# EAGLE design Qwiic LED Stick (EAGLE 9.5.2)
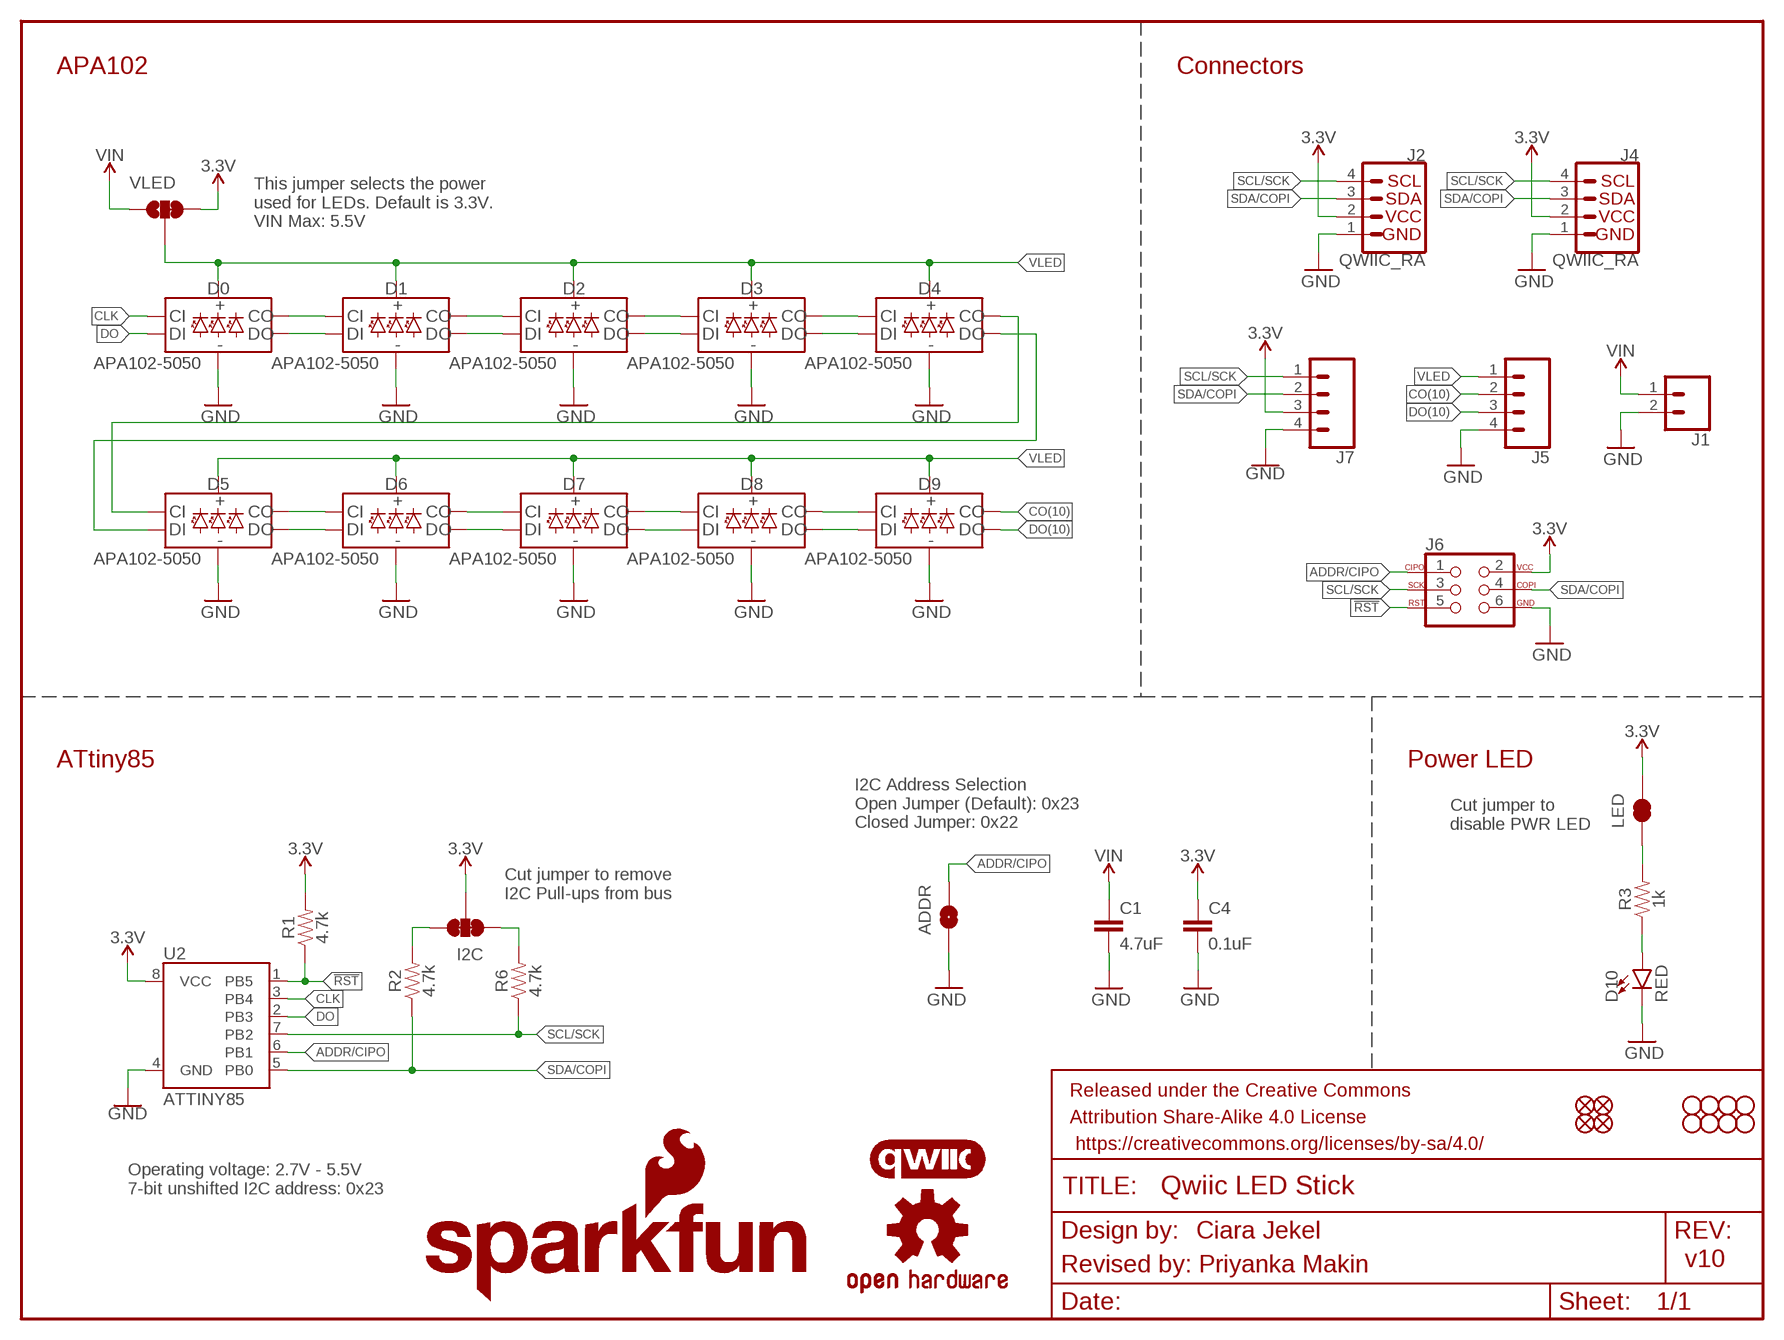
[diagram p0: schematic, sheet 1]

## Parts
ADDR  JUMPER-SMT_2_NO_SILK  [SMT-JUMPER_2_NO_SILK]
C1  4.7uF  4.7UF-0603-6.3V-(10%)  [0603]
C4  0.1uF  0.1UF-0603-25V-(+80/-20%)  [0603]
D0  APA102-5050  [APA102-5050]
D1  APA102-5050  [APA102-5050]
D2  APA102-5050  [APA102-5050]
D3  APA102-5050  [APA102-5050]
D4  APA102-5050  [APA102-5050]
D5  APA102-5050  [APA102-5050]
D6  APA102-5050  [APA102-5050]
D7  APA102-5050  [APA102-5050]
D8  APA102-5050  [APA102-5050]
D9  APA102-5050  [APA102-5050]
D10  RED  LED-RED0603  [LED-0603]
FRAME1  FRAME-LETTER  [CREATIVE_COMMONS]
H1  STAND-OFF  [STAND-OFF]
H2  STAND-OFF  [STAND-OFF]
H3  STAND-OFF  [STAND-OFF]
H4  STAND-OFF  [STAND-OFF]
I2C  JUMPER-SMT_3_2-NC_TRACE_SILK  [SMT-JUMPER_3_2-NC_TRACE_SILK]
J1  CONN_021X02_NO_SILK  [1X02_NO_SILK]
J2  QWIIC_RA  QWIIC_CONNECTORJS-1MM  [JST04_1MM_RA]
J4  QWIIC_RA  QWIIC_CONNECTORJS-1MM  [JST04_1MM_RA]
J5  CONN_041X04_NO_SILK  [1X04_NO_SILK]
J6  AVR_SPI_PROG_3X2TESTPOINTS  [2X3_TEST_POINTS]
J7  CONN_041X04_NO_SILK_NO_POP  [1X04_NO_SILK]
JP1  FIDUCIALUFIDUCIAL  [FIDUCIAL-MICRO]
JP2  FIDUCIALUFIDUCIAL  [FIDUCIAL-MICRO]
JP3  STAND-OFF  [STAND-OFF]
JP4  STAND-OFF  [STAND-OFF]
JP5  FIDUCIALUFIDUCIAL  [FIDUCIAL-MICRO]
JP6  FIDUCIALUFIDUCIAL  [FIDUCIAL-MICRO]
JP7  STAND-OFF  [STAND-OFF]
JP8  STAND-OFF  [STAND-OFF]
LED  JUMPER-SMT_2_NC_TRACE_SILK  [SMT-JUMPER_2_NC_TRACE_SILK]
LOGO1  OSHW-LOGOMINI  [OSHW-LOGO-MINI]
LOGO2  SFE_LOGO_NAME.2_INCH  [SFE_LOGO_NAME_.2]
LOGO3  QWIIC_LOGO_5MM  [QWIIC_5MM]
LOGO4  SFE_LOGO_FLAME.2_INCH  [SFE_LOGO_FLAME_.2]
LOGO5  SFE_LOGO_NAME.2_INCH  [SFE_LOGO_NAME_.2]
R1  4.7k  4.7KOHM-0603-1/10W-1%  [0603]
R2  4.7k  4.7KOHM-0603-1/10W-1%  [0603]
R3  1k  1KOHM-0603-1/10W-1%  [0603]
R6  4.7k  4.7KOHM-0603-1/10W-1%  [0603]
U2  ATTINY85  [ATTINY85]
VLED  JUMPER-SMT_3_1-NC_TRACE_SILK  [SMT-JUMPER_3_1-NC_TRACE_SILK]

## Nets
3.3V: C4.1 I2C.2 J2.2 J4.2 J6.2 J7.3 LED.2 R1.2 U2.8(VCC) VLED.3
!RST: J6.5 R1.1 U2.1(PB5)
ADDR/CIPO: ADDR.2 J6.1 U2.6(PB1)
CLK: D0.P2(CI) U2.3(PB4)
CO(10): D9.P5(CO) J5.2
DO: D0.P1(DI) U2.2(PB3)
DO(10): D9.P6(DO) J5.3
GND: ADDR.1 C1.2 C4.2 D0.P3(GND) D1.P3(GND) D2.P3(GND) D3.P3(GND) D4.P3(GND) D5.P3(GND) D6.P3(GND) D7.P3(GND) D8.P3(GND) D9.P3(GND) D10.C J1.2 J2.1 J4.1 J5.4 J6.6 J7.4 U2.4(GND)
N$3: D10.A R3.1
N$4: LED.1 R3.2
N$5: I2C.3 R2.2
N$6: I2C.1 R6.2
N$8: D8.P6(DO) D9.P1(DI)
N$9: D8.P5(CO) D9.P2(CI)
N$10: D7.P5(CO) D8.P2(CI)
N$11: D7.P6(DO) D8.P1(DI)
N$12: D6.P5(CO) D7.P2(CI)
N$13: D6.P6(DO) D7.P1(DI)
N$14: D5.P5(CO) D6.P2(CI)
N$15: D5.P6(DO) D6.P1(DI)
N$16: D4.P5(CO) D5.P2(CI)
N$17: D4.P6(DO) D5.P1(DI)
N$18: D3.P5(CO) D4.P2(CI)
N$19: D3.P6(DO) D4.P1(DI)
N$20: D2.P6(DO) D3.P1(DI)
N$21: D2.P5(CO) D3.P2(CI)
N$22: D1.P6(DO) D2.P1(DI)
N$23: D1.P5(CO) D2.P2(CI)
N$24: D0.P5(CO) D1.P2(CI)
N$25: D0.P6(DO) D1.P1(DI)
SCL/SCK: J2.4 J4.4 J6.3 J7.1 R6.1 U2.7(PB2)
SDA/COPI: J2.3 J4.3 J6.4 J7.2 R2.1 U2.5(PB0)
VIN: C1.1 J1.1 VLED.1
VLED: D0.P4(VCC) D1.P4(VCC) D2.P4(VCC) D3.P4(VCC) D4.P4(VCC) D5.P4(VCC) D6.P4(VCC) D7.P4(VCC) D8.P4(VCC) D9.P4(VCC) J5.1 VLED.2

## Notes on the sheet
- APA102 | Connectors
- This jumper selects the power 
  used for LEDs. Default is 3.3V.
  VIN Max: 5.5V
- ATtiny85 | Power LED
- I2C Address Selection
  Open Jumper (Default): 0x23
  Closed Jumper: 0x22
- Cut jumper to 
  disable PWR LED
- Cut jumper to remove 
  I2C Pull-ups from bus
- Operating voltage: 2.7V - 5.5V
  7-bit unshifted I2C address: 0x23
- Ciara Jekel
- Revised by: Priyanka Makin | v10

## Library data of the parts
ADDR = SparkFun-Jumpers:JUMPER-SMT_2_NO: Normally open jumper This jumper has two pads in close proximity to each other. Apply solder to close the connection. Round pads are easier to solder for beginners, but are a lot larger. SparkFun Product that uses the round pads: SparkFun EL Sequencer <https://www.sparkfun.com/products/12781>
C1 = SparkFun-Capacitors:4.7UF: 4.7µF ceramic capacitors A capacitor is a passive two-terminal electrical component used to store electrical energy temporarily in an electric field.; PROD_ID: CAP-08280
C4 = SparkFun-Capacitors:0.1UF: 0.1µF ceramic capacitors A capacitor is a passive two-terminal electrical component used to store electrical energy temporarily in an electric field.; PROD_ID: CAP-00810
D0 D1-D9 = SparkFun-LED:APA102: Addressable RGB LED - 2 Wire Common names: APA102, Dotstar, etc. Packages: 5050 2020 SparkFun Products: SparkFun Lumenati Boards <https://www.sparkfun.com/categories/405>; PROD_ID: DIO-13739
D10 = SparkFun-LED:LED-RED: Red SMD LED Used in manufacturing of most products at SparkFun Packages: 0603 - SMD 0603 package [Product Link] <http://docs.avagotech.com/docs/AV02-0551EN> 0603 SMART - SMD 0603 SMART package ( more efficient and expensive)[Product Link] <http://www.osram-os.com/Graphics/XPic2/00077099_0.pdf> 1206 - SMD1206 package [Product Link] <https://www.sparkfun.com/datasheets/DevTools/LilyPad/Q150OVS4.pdff> SparkFun Products: Pro Mini 328 -5V <https://www.sparkfun.com/products/821> RedBoard <https://www.sparkfun.com/products/12757> IOIO-OTG <https://www.sparkfun.com/products/13613>; PROD_ID: DIO-00819
FRAME1 = SparkFun-Aesthetics:FRAME-LETTER: Schematic Frame - Letter Standard 8.5x11 US Letter frame
H1-H4 JP3 JP4 JP7 JP8 = SparkFun-Hardware:STAND-OFF: Stand Off Drill holes for mechanically mounting via screws, standoffs, etc. Note: Use the keepout ring to avoid running the screw head into surrounding components. Variant Overviews STAND-OFF - Mechanical footprint for a #4 phillips button head screw. STAND-OFF-TIGHT - Mechanical footprint for a #4 phillips button head screw, Example SparkFun Products Screw - Phillips Head (1/4", 4-40, 10 pack) <https://www.sparkfun.com/products/10453> (PRT-10453) Screw - Phillips Head (1/2", 4-40, 10 pack) <https://www.sparkfun.com/products/10452> (PRT-10452) Screw - Phillips Head (3/4", 4-40, 10 pack) <https://www.sparkfun.com/products/10451> (PRT-10451) Screw - Phillips Head (1", 4-40, 10 pack) <https://www.sparkfun.com/products/10450> (PRT-10450)
I2C = SparkFun-Jumpers:JUMPER-SMT_3_2-NC_TRACE: Normally closed trace jumper (2 of 2 connections) This jumper has a trace between all three pads so they are normally closed (NC). Use a razor knife to open the connection(s). For best results follow the IPC guidelines for cutting traces: Cutout at least 0.063 mm (0.005 in). Remove all loose material to clean up the cut area. Seal the cut with an approved epoxy. Reapply solder to reclose the connection(s).
J1 = SparkFun-Connectors:CONN_02: Multi connection point. Often used as Generic Header-pin footprint for 0.1 inch spaced/style header connections On any of the 0.1 inch spaced packages, you can populate with these: Break Away Headers - Straight <https://www.sparkfun.com/products/116> (PRT-00116) Break Away Male Headers - Right Angle <https://www.sparkfun.com/products/553> (PRT-00553) Female Headers <https://www.sparkfun.com/products/115> (PRT-00115) Break Away Headers - Machine Pin <https://www.sparkfun.com/products/117> (PRT-00117) Break Away Female Headers - Swiss Machine Pin <https://www.sparkfun.com/products/743> (PRT-00743) For SCREWTERMINALS and SPRING TERMINALS visit here: Screw Terimnals on SparkFun.com <https://www.sparkfun.com/search/results?term=Screw+Terminals> (5mm/3.5mm/2.54mm spacing) This device is also useful as a general connection point to wire up your design to another part of your project. Our various solder wires solder well into these plated through hole pads. Hook-Up Wire - Assortment (Stranded, 22 AWG) <https://www.sparkfun.com/products/11375> (PRT-11375) Hook-Up Wire - Assortment (Solid Core, 22 AWG) <https://www.sparkfun.com/products/11367> (PRT-11367) View the entire wire category on our website here <https://www.sparkfun.com/categories/141> Special notes: Molex polarized connector foot print use with: PRT-08233 with associated crimp pins and housings. 2.54_SCREWTERM for use with PRT-10571. 3.5mm Screw Terminal footprints for PRT-08084 5mm Screw Terminal footprints for use with PRT-08432
J2 J4 = SparkFun-Connectors:QWIIC_CONNECTOR: SparkFun I2C Standard Qwiic Connector An SMD 1mm pitch JST connector makes it easy and quick (get it? Qwiic?) to connect I2C devices to each other. The Qwiic system <http://www.sparkfun.com/qwiic> enables fast and solderless connection between popular platforms and various sensors and actuators. We carry 200mm <https://www.sparkfun.com/products/14204>, 100mm <https://www.sparkfun.com/products/14205>, 50mm <https://www.sparkfun.com/products/14206>, and breadboard friendly <https://www.sparkfun.com/products/14207> Qwiic cables. We also offer 10 pcs strips <https://www.sparkfun.com/products/14323> the SMD connectors.; PROD_ID: CONN-13694; VALUE: QWIIC_RIGHT_ANGLE
J5 = SparkFun-Connectors:CONN_04: Multi connection point. Often used as Generic Header-pin footprint for 0.1 inch spaced/style header connections On any of the 0.1 inch spaced packages, you can populate with these: Break Away Headers - Straight <https://www.sparkfun.com/products/116> (PRT-00116) Break Away Male Headers - Right Angle <https://www.sparkfun.com/products/553> (PRT-00553) Female Headers <https://www.sparkfun.com/products/115> (PRT-00115) Break Away Headers - Machine Pin <https://www.sparkfun.com/products/117> (PRT-00117) Break Away Female Headers - Swiss Machine Pin <https://www.sparkfun.com/products/743> (PRT-00743) For SCREWTERMINALS and SPRING TERMINALS visit here: Screw Terimnals on SparkFun.com <https://www.sparkfun.com/search/results?term=Screw+Terminals> (5mm/3.5mm/2.54mm spacing) This device is also useful as a general connection point to wire up your design to another part of your project. Our various solder wires solder well into these plated through hole pads. Hook-Up Wire - Assortment (Stranded, 22 AWG) <https://www.sparkfun.com/products/11375> (PRT-11375) Hook-Up Wire - Assortment (Solid Core, 22 AWG) <https://www.sparkfun.com/products/11367> (PRT-11367) View the entire wire category on our website here <https://www.sparkfun.com/categories/141> Special notes: Molex polarized connector foot print use with SKU : PRT-08231 with associated crimp pins and housings. 1MM SMD Version SKU: PRT-10208; PROD_ID: CONN-09696
J6 = SparkFun-Connectors:AVR_SPI_PROG_3X2: AVR ISP 6 Pin This is the reduced ISP connector for AVR programming. Common on Arduino. This footprint will take up less PCB space and can be used with a 10-pin to 6-pin adapter such as SKU: BOB-08508 **Special note about "TEST_POINT" package. The stop mask is on the top side, so if you want your programming test points to be on the bottom of your board, make sure to place this package on the bottom side of the board. This also ensure that the orientation to program from the bottom side will be correct. SparkFun Products: SparkFun ISP Pogo Adapter <https://www.sparkfun.com/products/11591> - NS Tiny AVR Programmer <https://www.sparkfun.com/products/11801> -PTH
J7 = SparkFun-Connectors:CONN_04: Multi connection point. Often used as Generic Header-pin footprint for 0.1 inch spaced/style header connections On any of the 0.1 inch spaced packages, you can populate with these: Break Away Headers - Straight <https://www.sparkfun.com/products/116> (PRT-00116) Break Away Male Headers - Right Angle <https://www.sparkfun.com/products/553> (PRT-00553) Female Headers <https://www.sparkfun.com/products/115> (PRT-00115) Break Away Headers - Machine Pin <https://www.sparkfun.com/products/117> (PRT-00117) Break Away Female Headers - Swiss Machine Pin <https://www.sparkfun.com/products/743> (PRT-00743) For SCREWTERMINALS and SPRING TERMINALS visit here: Screw Terimnals on SparkFun.com <https://www.sparkfun.com/search/results?term=Screw+Terminals> (5mm/3.5mm/2.54mm spacing) This device is also useful as a general connection point to wire up your design to another part of your project. Our various solder wires solder well into these plated through hole pads. Hook-Up Wire - Assortment (Stranded, 22 AWG) <https://www.sparkfun.com/products/11375> (PRT-11375) Hook-Up Wire - Assortment (Solid Core, 22 AWG) <https://www.sparkfun.com/products/11367> (PRT-11367) View the entire wire category on our website here <https://www.sparkfun.com/categories/141> Special notes: Molex polarized connector foot print use with SKU : PRT-08231 with associated crimp pins and housings. 1MM SMD Version SKU: PRT-10208
JP1 JP2 JP5 JP6 = SparkFun-Aesthetics:FIDUCIAL: Fiducial Alignment Points Point-of-reference for pick-and-place machines and other optical instruments.
LED = SparkFun-Jumpers:JUMPER-SMT_2_NC_TRACE: Normally closed trace jumper This jumper has a trace between two pads so it's normally closed (NC). Use a razor knife to open the connection. For best results follow the IPC guidelines for cutting traces: Cutout at least 0.063 mm (0.005 in). Remove all loose material to clean up the cut area. Seal the cut with an approved epoxy. Reapply solder to reclose the connection.
LOGO1 = SparkFun-Aesthetics:OSHW-LOGO: Open-Source Hardware (OSHW) Logo This logo indicates the piece of hardware it is found on incorporates a OSHW license and/or adheres to the definition of open source hardware found here: http://freedomdefined.org/OSHW
LOGO2 LOGO5 = SparkFun-Aesthetics:SFE_LOGO_NAME: SparkFun Font Logo This is the SparkFun name logo. The logo on the schematic will always be the same size; the package variant is the height of the flame part of the logo (or the height the flame would be, if it were drawn). Default layer for the logo on the board is tSilk.
LOGO3 = SparkFun-Aesthetics:QWIIC_LOGO: Qwiic Logos for placement on schematic and PCB. The 5.5mm silk logo is best for placing next to Qwiic connector.
LOGO4 = SparkFun-Aesthetics:SFE_LOGO_FLAME: SparkFun Flame Logo This is the SparkFun flame logo. The logo on the schematic will always be the same size; the package variant is the height of the flame. Default layer for the logo on the board is tSilk.
R1 R2 R6 = SparkFun-Resistors:4.7KOHM: 4.7kΩ resistor A resistor is a passive two-terminal electrical component that implements electrical resistance as a circuit element. Resistors act to reduce current flow, and, at the same time, act to lower voltage levels within circuits. - Wikipedia; PROD_ID: RES-07857
R3 = SparkFun-Resistors:1KOHM: 1kΩ resistor A resistor is a passive two-terminal electrical component that implements electrical resistance as a circuit element. Resistors act to reduce current flow, and, at the same time, act to lower voltage levels within circuits. - Wikipedia; PROD_ID: RES-07856
U2 = SparkFun-IC-Microcontroller:ATTINY85; PROD_ID: IC-09092
VLED = SparkFun-Jumpers:JUMPER-SMT_3_1-NC_TRACE: Normally closed trace jumper (1 of 2 connections) This jumper has a trace between two pads so it's normally closed (NC). The other connection is normally open (NO). Use a razor knife to open the connection. For best results follow the IPC guidelines for cutting traces: Cutout at least 0.063 mm (0.005 in). Remove all loose material to clean up the cut area. Seal the cut with an approved epoxy. Reapply solder to reclose the connection, or to close the NO connection.

## Net classes
1 power: width 0.203 mm

## Board
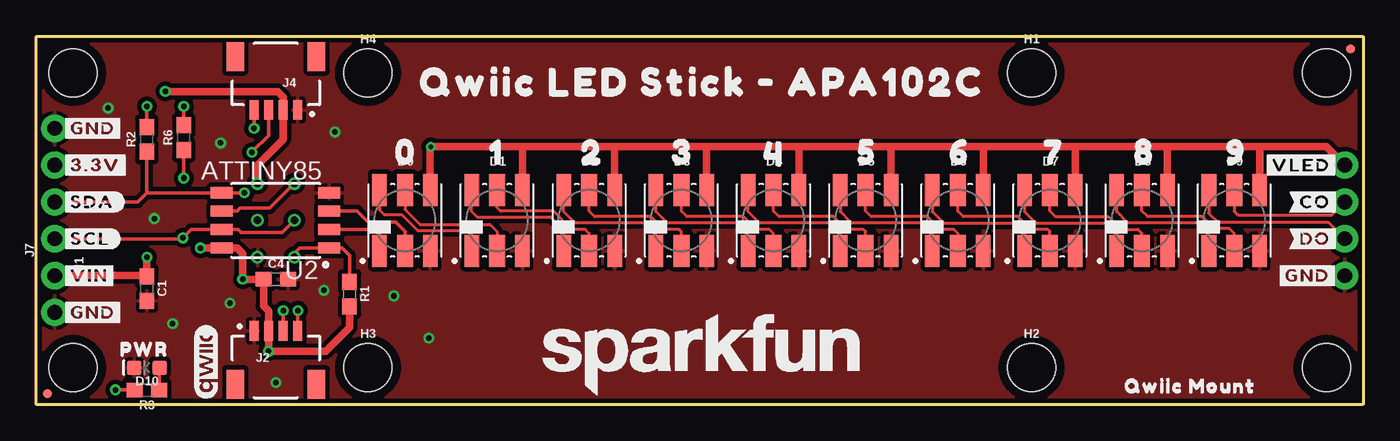
[diagram p1: board, top side]
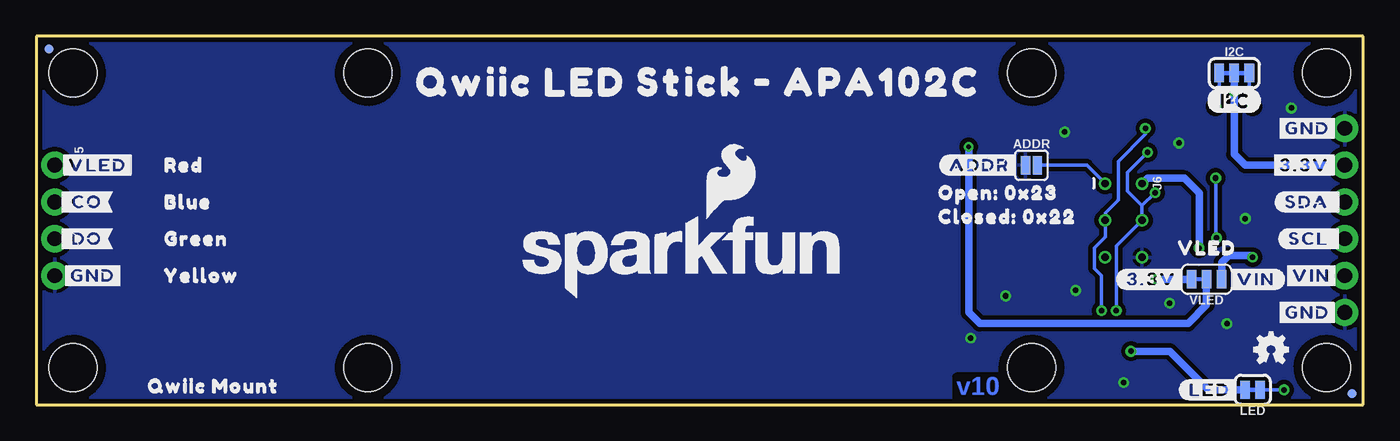
[diagram p2: board, bottom side, seen from below]

Size 91.44 x 25.4 mm. Coordinates in mm from the lower left corner, seen from the top.
Outline: 91.44,0 0,0 0,25.4 91.44,25.4 91.44,0
Copper layers (1*16): Top 0.035mm / dielectric 1.5mm / Bottom 0.035mm
Design rules "SparkFun-2-Layer-General-JLCPCB": minimum track width 7mil, minimum drill 0.3mm, track to track 7mil, track to pad 7mil, pad to pad 7mil, via to via 7mil, smd to smd 7mil, copper to edge 7mil, drill to drill 7mil, minimum pad ring 7mil, minimum via ring 7mil, stop-mask expansion 3mil, vias tented up to drill 25mil, thermal gap 10mil

### Footprints (pad centres in the part's own frame; a part is rotated, then mirrored left to right if it is on the bottom)
SMT-JUMPER_2_NO_SILK = smd 0.635 x 1.27: 1 -0.406,0; 2 0.406,0
0603 = smd 1.1 x 1: 1 -0.85,0; 2 0.85,0
APA102-5050 = smd 1 x 2.2: P1 -1.75,-2.1; P3 1.75,-2.1; P4 1.75,2.1; P6 -1.75,2.1 | smd 1.1 x 2.2: P2 0,-2.1; P5 0,2.1
LED-0603 = smd 1 x 1: A -0.877,0; C 0.877,0
STAND-OFF = hole 3.302: 0,0
SMT-JUMPER_3_2-NC_TRACE_SILK = smd 0.66 x 1.27: 1 -1.041,0; 2 0,0; 3 1.041,0
1X02_NO_SILK = drill 1.016 pad 1.88: 1 0,0; 2 2.54,0
JST04_1MM_RA = smd 0.6 x 1.35: 1 -1.5,0; 2 -0.5,0; 3 0.5,0; 4 1.5,0 | smd 1.2 x 2: NC1 2.8,-3.675; NC2 -2.8,-3.675
1X04_NO_SILK = drill 1.016 pad 1.88: 1 0,0; 2 2.54,0; 3 5.08,0; 4 7.62,0
2X3_TEST_POINTS = drill 0.508: 1 -2.54,-1.27; 2 -2.54,1.27; 3 0,-1.27; 4 0,1.27; 5 2.54,-1.27; 6 2.54,1.27
FIDUCIAL-MICRO = smd 0.635 x 0.635: 1 0,0
SMT-JUMPER_2_NC_TRACE_SILK = smd 0.66 x 1.27: 1 -0.521,0; 2 0.521,0
ATTINY85 = smd 1.524 x 0.762: 1 -3.683,1.905; 2 -3.683,0.635; 3 -3.683,-0.635; 4 -3.683,-1.905; 5 3.727,-1.905; 6 3.727,-0.635; 7 3.727,0.635; 8 3.727,1.905
SMT-JUMPER_3_1-NC_TRACE_SILK = smd 0.66 x 1.27: 1 -1.041,0; 2 0,0; 3 1.041,0

### Placement (x,y rotation side)
ADDR  22.86,16.51 0 bottom
C1  7.62,8 270 top
C4  16.51,8.64 0 top
D0  25.4,12.7 0 top
D1  31.75,12.7 0 top
D2  38.1,12.7 0 top
D3  44.45,12.7 0 top
D4  50.8,12.7 0 top
D5  57.15,12.7 0 top
D6  63.5,12.7 0 top
D7  69.85,12.7 0 top
D8  76.2,12.7 0 top
D9  82.55,12.7 0 top
D10  7.62,2.54 180 top
FRAME1  10.16,-8.89 0 top  (outside the outline)
H1  68.58,22.86 0 top
H2  68.58,2.54 0 top
H3  22.86,2.54 0 top
H4  22.86,22.86 0 top
I2C  8.89,22.86 0 bottom
J1  1.27,8.89 270 top
J2  16.51,5.08 0 top
J4  16.51,20.32 180 top
J5  90.17,16.51 270 bottom
J6  16.51,12.7 270 bottom
J7  1.27,11.43 90 top
JP1  0.76,0.76 270 bottom
JP2  90.55,24.51 90 top
JP3  2.54,2.54 90 top
JP4  2.54,22.86 90 top
JP5  90.55,24.51 270 bottom
JP6  0.76,0.76 90 top
JP7  88.9,22.86 0 top
JP8  88.9,2.54 0 top
LED  7.62,1.02 180 bottom
LOGO1  6.35,3.81 0 bottom
LOGO2  45.85,3.43 0 top
LOGO3  11.68,2.92 90 top
LOGO4  43.56,15.37 0 bottom
LOGO5  46.99,10.16 0 bottom
R1  21.59,7.62 270 top
R2  7.62,18.29 90 top
R3  7.62,1.02 180 top
R6  10.16,18.41 90 top
U2  16.51,12.7 180 top
U$1  [#GND#0]  1.65,6.35 0 top
U$2  [#GND#0]  6.1,6.35 0 bottom
U$3  [#GND#0]  1.65,19.05 0 top
U$4  [#GND#0]  6.1,19.05 0 bottom
U$5  [#GND#0]  85.34,8.89 0 top
U$6  [#CO#0]  86.36,13.97 0 top
U$7  [#DO#0]  86.36,11.43 0 top
U$8  [#GND#0]  89.79,8.89 0 bottom
U$9  [#VLED#0]  84.45,16.51 0 top
U$10  [#ADDR#0]  29.21,16.51 0 bottom
U$11  [(I_SUPER2_C)]  10.79,20.95 0 bottom
U$12  [#VLED#0]  89.92,16.51 0 bottom
U$14  [#3#3V#0]  1.65,16.51 0 top
U$15  [#_DO#0]  90.04,11.43 0 bottom
U$16  [#_CO#0]  90.04,13.97 0 bottom
U$17  [#3#3V#0]  6.48,16.51 0 bottom
U$18  [#VIN#0]  1.65,8.89 0 top
U$19  [#VIN#0]  5.59,8.89 0 bottom
U$20  [#SDA#0]  1.65,13.97 0 top
U$21  [#SDA_#0]  6.1,13.97 0 bottom
U$22  [#SCL#0]  1.65,11.43 0 top
U$23  [#SCL_#0]  5.84,11.43 0 bottom
U$24  [#LED#0]  12.7,1.02 0 bottom
U$25  [#3#3V#1]  17.02,8.64 0 bottom
U$26  [PWR0]  5.08,3.81 0 top
U$28  [VLED0]  13.46,10.79 0 bottom
U$29  [#VIN#4]  9.4,8.64 0 bottom
U$30  [QWIIC_MOUNT5]  74.3,1.27 0 top
U$31  [00]  23.5,17.4 0 top
U$32  [10]  29.97,17.4 0 top
U$33  [20]  36.32,17.4 0 top
U$34  [30]  42.55,17.4 0 top
U$35  [40]  48.9,17.27 0 top
U$36  [50]  55.37,17.4 0 top
U$37  [60]  61.72,17.4 0 top
U$38  [70]  68.2,17.4 0 top
U$39  [80]  74.42,17.4 0 top
U$40  [90]  80.77,17.4 0 top
U$41  [RED0]  83.31,16.51 0 bottom
U$42  [BLUE0]  83.31,13.97 0 bottom
U$43  [GREEN0]  83.31,11.43 0 bottom
U$44  [YELLOW0]  83.31,8.89 0 bottom
U$45  [OPEN#_0X230]  29.97,14.61 0 bottom
U$46  [CLOSED#_0X220]  29.97,12.95 0 bottom
U$47  [QWIIC_MOUNT5]  84.45,1.27 0 bottom
U$48  [QWIIC_LED_STICK_#_APA102C0]  25.02,22.23 0 top
U$49  [QWIIC_LED_STICK_#_APA102C0]  66.67,22.23 0 bottom
VLED  10.79,8.64 180 bottom

### Tracks (layer width: path | path; a pad name or v marks a point on that pad's centre or on a via)
3.3V  (via drill 0.38)
  Top 0.254: 16.02,3.68 v16.01,3.67
  Top 0.508: v16.01,3.67 J2.2 16.01,6.47 15.66,6.82 C4.1 v14.22,8.64 14.22,10.41 13.84,10.79 U2.8 v11.3,10.79 | 16.02,3.68 19.94,3.68 21.59,5.33 R1.2 | J6.2 15.24,16.51 17.01,18.28 J4.2 17.01,21.21 16.63,21.59 v8.89,21.59
  Bottom 0.508: LED.2 10.67,1.02 13.33,3.67 v16.01,3.67 | VLED.3 v14.22,8.64 | I2C.2 v8.89,21.59 8.89,17.27 8.13,16.51 J7.3 | v11.3,10.79 11.3,14.61 12.32,15.62 14.86,15.62 J6.2
!RST
  Top 0.254: J6.5 17.78,10.41 18.16,10.79 U2.1 21.08,10.79 21.59,10.29 R1.1
ADDR/CIPO
  Top 0.254: U2.6 13.85,13.34 14.06,13.54 16.08,13.54 J6.1
  Bottom 0.254: J6.1 19.05,16.51 ADDR.2
CLK
  Top 0.254: U2.3 22.1,13.34 22.86,12.57 24.77,12.57 25.4,11.94 D0.P2
CO(10)
  Top 0.203: D9.P5 82.55,13.34 82.8,13.08 89.28,13.08 J5.2
DO
  Top 0.254: U2.2 23.5,12.06 23.65,11.91 D0.P1
DO(10)
  Top 0.203: D9.P6 80.8,13.18 81.41,12.57 89.03,12.57 J5.3
GND  (via drill 0.38)
  other vias: 4.95,20.45 12.7,18.03 20.57,18.8 8.13,12.83 9.4,5.59 16.51,1.52 13.34,6.99 19.81,7.87 24.64,7.49 27.05,4.57
  pour Bottom (isolate 0.305): 91.44,0 0,0 0,25.4 91.44,25.4
  pour Top (isolate 0.305): 91.44,0 0,0 0,25.4 91.44,25.4
N$3
  Top 0.254: R3.1 8.47,2.51 D10.A
N$4  (via drill 0.38)
  Top 0.254: v5.46,1.02 R3.2
  Bottom 0.254: LED.1 v5.46,1.02
N$5  (via drill 0.38)
  Top 0.254: R2.2 v7.62,20.57
  Bottom 0.254: v7.62,20.57 7.85,20.8 I2C.3
N$6  (via drill 0.38)
  Top 0.254: R6.2 v10.16,20.57
  Bottom 0.254: v10.16,20.57 9.93,20.8 I2C.1
N$8
  Top 0.203: D9.P1 80.8,11.94 80.22,12.52 75.23,12.52 74.45,13.31 D8.P6
N$9
  Top 0.203: D8.P5 76.2,13.34 76.58,12.95 80.34,12.95 81.15,12.14 82.22,12.14 82.55,11.81 D9.P2
N$10
  Top 0.203: D7.P5 69.85,13.34 70.23,12.95 73.86,12.95 74.73,12.09 75.92,12.09 76.2,11.81 D8.P2
N$11
  Top 0.203: D7.P6 68.1,13.31 68.89,12.52 73.71,12.52 74.45,11.78 D8.P1
N$12
  Top 0.203: D6.P5 63.5,13.34 63.88,12.95 67.64,12.95 68.5,12.09 69.7,12.09 69.85,11.94 D7.P2
N$13
  Top 0.203: D6.P6 61.75,13.31 62.53,12.52 67.49,12.52 68.1,11.91 D7.P1
N$14
  Top 0.203: D5.P5 57.15,13.34 57.53,12.95 61.42,12.95 62.28,12.09 63.22,12.09 63.5,11.81 D6.P2
N$15
  Top 0.203: D5.P6 55.4,13.31 56.19,12.52 61.27,12.52 61.75,12.04 D6.P1
N$16
  Top 0.203: D4.P5 50.8,13.34 51.18,12.95 54.94,12.95 55.8,12.09 57,12.09 57.15,11.94 D5.P2
N$17
  Top 0.203: D4.P6 49.05,13.31 49.84,12.52 54.79,12.52 55.4,11.91 D5.P1
N$18
  Top 0.203: D3.P5 44.45,13.34 44.83,12.95 48.72,12.95 49.58,12.09 50.52,12.09 50.8,11.81 D4.P2
N$19
  Top 0.203: D3.P6 42.7,13.31 43.48,12.52 48.56,12.52 49.05,12.04 D4.P1
N$20
  Top 0.203: D2.P6 36.35,13.31 37.13,12.52 42.22,12.52 42.7,12.04 D3.P1
N$21
  Top 0.203: D2.P5 38.1,13.34 38.48,12.95 42.37,12.95 43.23,12.09 44.3,12.09 44.45,11.94 D3.P2
N$22
  Top 0.203: D1.P6 30,13.31 30.4,12.9 35.48,12.9 36.35,12.04 D2.P1
N$23
  Top 0.203: D1.P5 31.75,13.59 32,13.34 35.64,13.34 36.88,12.09 37.82,12.09 38.1,11.81 D2.P2
N$24
  Top 0.203: D0.P5 25.4,13.46 26.44,12.42 31.27,12.42 31.75,11.94 D1.P2
N$25
  Top 0.203: D0.P6 23.65,13.43 23.98,13.11 25.18,13.11 26.27,12.01 29.84,12.01 30,11.86 D1.P1
SCL/SCK  (via drill 0.38)
  Top 0.254: J6.3 16.94,11.86 14.13,11.86 13.93,12.06 U2.7 10.67,12.06 v10.1,11.49 10.03,11.43 J7.1 | J2.4 18.01,6.45 v18.03,6.48 | J4.4 v15.01,19.05 | R6.1 v10.16,15.62
  Bottom 0.254: v18.03,6.48 18.03,8.89 18.54,9.4 18.54,10.79 17.78,11.56 J6.3 17.78,13.21 16.89,14.1 16.89,16.76 15.01,18.64 v15.01,19.05 | v10.16,15.62 10.16,11.56 v10.1,11.49
SDA/COPI  (via drill 0.38)
  Top 0.254: v14.35,14.61 U2.5 7.62,14.61 | J2.3 v17.01,6.47 v17.02,6.48 | J4.3 16.01,18.55 v14.86,17.4 | J7.2 6.99,13.97 7.62,14.61 | 7.62,14.61 R2.1
  Bottom 0.254: 15.24,13.72 J6.4 17.02,10.92 v17.02,6.48 | 15.24,13.72 v14.35,14.61 | v14.86,17.4 16.26,16 16.26,14.73 15.24,13.72
VIN  (via drill 0.38)
  Top 0.508: J1.1 7.58,8.89 C1.1 v7.62,10.16
  Bottom 0.508: v7.62,10.16 7.75,10.29 9.27,10.29 9.75,9.8 VLED.1
VLED  (via drill 0.3)
  Top 0.305: v27.18,17.78 27.15,17.75
  Top 0.508: 27.15,17.75 D0.P4 | v27.18,17.78 33.5,17.78 | 33.5,17.78 39.85,17.78 | 39.85,17.78 46.2,17.78 | 46.2,17.78 52.55,17.78 | 52.55,17.78 58.9,17.78 | 58.9,17.78 65.25,17.78 | 65.25,17.78 71.6,17.78 | 71.6,17.78 77.95,17.78 | D8.P4 77.95,17.78 | D7.P4 71.6,17.78 | D6.P4 65.25,17.78 | D5.P4 58.9,17.78 | D4.P4 52.55,17.78 | D3.P4 46.2,17.78 | D2.P4 39.85,17.78 | D1.P4 33.5,17.78 | 77.95,17.78 84.3,17.78 | D9.P4 84.3,17.78 | J5.1 88.9,17.78 84.3,17.78
  Bottom 0.508: VLED.2 10.79,6.86 12.06,5.59 26.42,5.59 27.18,6.35 v27.18,17.78

### Text on the board
Bottom: v10
Measures: Units in Inches
tDocu: Ciara Jekel | Revised by: Priyanka Makin